# Altium schematic sheet 07 MIPI CSI.SchDoc
size A4
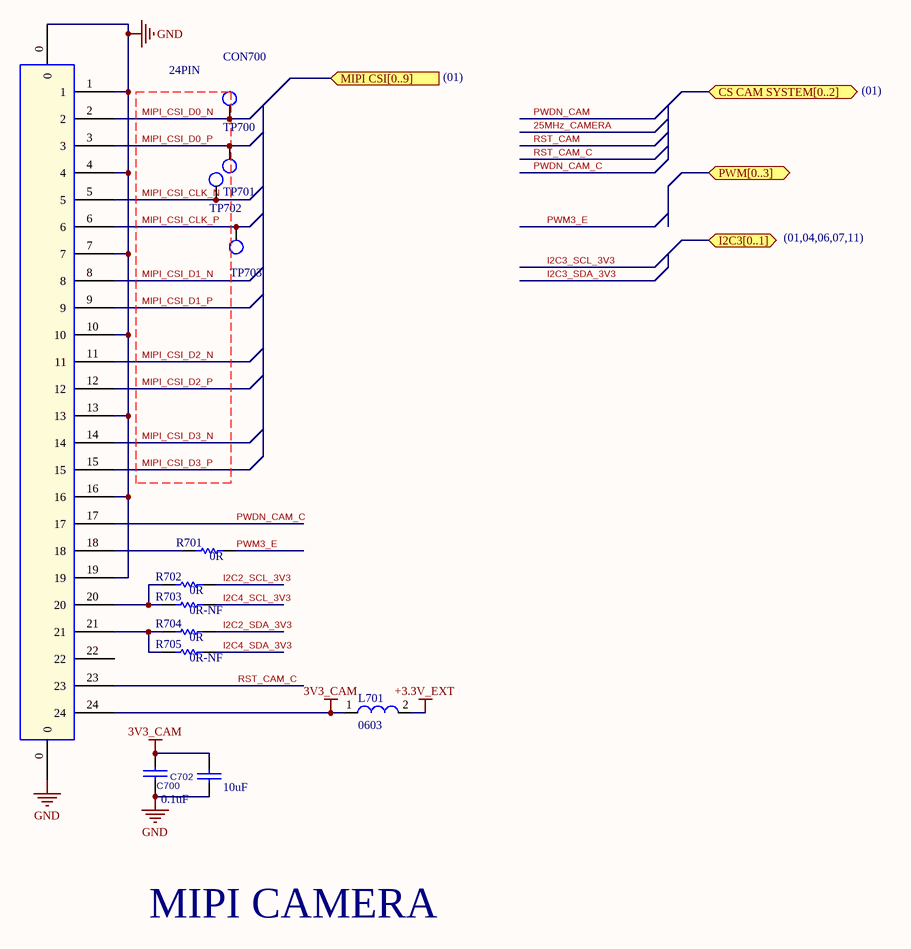
[diagram p0: 07 MIPI CSI.SchDoc]

## Parts
C700  0.1uF  [0402_CC]
C702  10uF  [0603_CC]
CON700  24PIN  [24-PIN FPC]
L701  0603  [0603_RES]
R701  0R  [0402_RES]
R702  0R  [0402_RES]
R703  0R-NF  [0402_RES]  (no BOM)
R704  0R  [0402_RES]
R705  0R-NF  [0402_RES]  (no BOM)
TP700  TEST POINT 15  [testpoint_15]  (value not drawn)  (no BOM)
TP701  TEST POINT 15  [testpoint_15]  (value not drawn)  (no BOM)
TP702  TEST POINT 15  [testpoint_15]  (value not drawn)  (no BOM)
TP703  TEST POINT 15  [testpoint_15]  (value not drawn)  (no BOM)

## Ports
CS CAM SYSTEM[0..2] (bidir), I2C3[0..1] (bidir), MIPI CSI[0..9] (in), PWM[0..3] (bidir)

## Nets
3V3_CAM: C700.1 C702.1 CON700.24 L701.1
+3.3V_EXT: L701.2
GND: C700.2 C702.2 CON700.0 CON700.1 CON700.4 CON700.7 CON700.10 CON700.13 CON700.16 CON700.19
I2C2_SCL_3V3: R702.2
I2C2_SDA_3V3: R704.2
I2C4_SCL_3V3: R703.2
I2C4_SDA_3V3: R705.2
MIPI_CSI_CLK_N: CON700.5 TP702.1
MIPI_CSI_CLK_P: CON700.6 TP703.1
MIPI_CSI_D0_N: CON700.2 TP700.1
MIPI_CSI_D0_P: CON700.3 TP701.1
MIPI_CSI_D1_N: CON700.8
MIPI_CSI_D1_P: CON700.9
MIPI_CSI_D2_N: CON700.11
MIPI_CSI_D2_P: CON700.12
MIPI_CSI_D3_N: CON700.14
MIPI_CSI_D3_P: CON700.15
PWDN_CAM_C: CON700.17
PWM3_E: R701.2
RST_CAM_C: CON700.23
NetCON700_18: CON700.18 R701.1
NetCON700_20: CON700.20 R702.1 R703.1
NetCON700_21: CON700.21 R704.1 R705.1

Not connected (* = marked no-connect by the designer): CON700 22

## Notes on the sheet
- (01)
- (01,04,06,07,11)
- MIPI CAMERA
- Sheet Title:
- Inventron
- Size:
- Drawn By:
- Revision:
- Project:
- Checked By:
- A4
- Sheet
- of
- Budotek Teknopark
- Dudullu OSB
- Des 2. Cadde No:8/30
- Umraniye / ISTANBUL
- Electronics and Software
- Date:
- Time:
- ©2020 Inventron Electronics and Software. All rights reserved.

## Library data of the parts
C700 = CAP-CL05B104KO5NNNC: CAP VER 0.1UF 16V X7R 0402; Manufacturer-1: SAMSUNG; Opt. Temp.: -55/+125; Class: Capacitor; Manufacturer Part Number-1: CL05B104KO5NNNC; Footprint: 0402; Manufacturer-2: *; Manufacturer Part Number-2: *; Inventron Stock No: *; Created By: LA; Created Date: 23.11.2018; Checked By: *; ASSY_OPT: *; Dimensions: *; Unit Price: 0,00499; Revision Date/Note: *; Price Break: 10K
C702 = CAP-JMK107BC6106MA-T: CAP CER 10UF 6.3V X6S 0603; Manufacturer-1: TAIYO YUDEN; Opt. Temp.: -55/+105; Class: Capacitor; Manufacturer Part Number-1: JMK107BC6106MA-T; Footprint: 0603; Manufacturer-2: *; Manufacturer Part Number-2: *; Inventron Stock No: *; Created By: LA; Created Date: 23.11.2018; Checked By: *; ASSY_OPT: *; Dimensions: *; Unit Price: 0,044; Revision Date/Note: *; Price Break: 4K
CON700 = CON-SFV24R-4STBE1HLF(GENIS): CONN FPC TOP 24POS 0.50MM R/A; Manufacturer-1: AMPHENOL; Opt. Temp.: -55/+105; Class: Connector; Manufacturer Part Number-1: SFV24R-4STBE1HLF; Footprint: *; Manufacturer-2: *; Manufacturer Part Number-2: *; Inventron Stock No: *; Created By: LA; Created Date: 06.05.2019; Checked By: *; ASSY_OPT: *; Dimensions: *; Unit Price: 0,19575; Revision Date/Note: *; Price Break: 3K
L701 = IND-FERRITE (RES 0 OHM) 0603: 0OHM 0603; Manufacturer Part Number-1: RC0603JR-070RL; Manufacturer-1: YAGEO; Class: Inductor; Footprint: 0603; Manufacturer-2: *; Inventron Stock No: *; Created By: EE; Checked By: *; ASSY_OPT: *; Dimensions: *; Revision Date/Note: *
R701-R705 = RES-RMCF0402ZT0R00: RES 0 OHM JUMPER 1/16W 0402; Manufacturer-1: STACKPOLE; Opt. Temp.: -55/+155; Class: Resistor; Manufacturer Part Number-1: RMCF0402ZT0R00; Footprint: 0402; Manufacturer-2: *; Manufacturer Part Number-2: *; Inventron Stock No: *; Created By: LA; Created Date: 23.11.2018; Checked By: *; ASSY_OPT: *; Dimensions: *; Unit Price: 0,00127; Revision Date/Note: *; Price Break: 10K